# Altium schematic sheet WeightPuzzle.SchDoc: WEIGHT PUZZLE
size A4; DrawnBy: Elisha Tam; Revision: 1
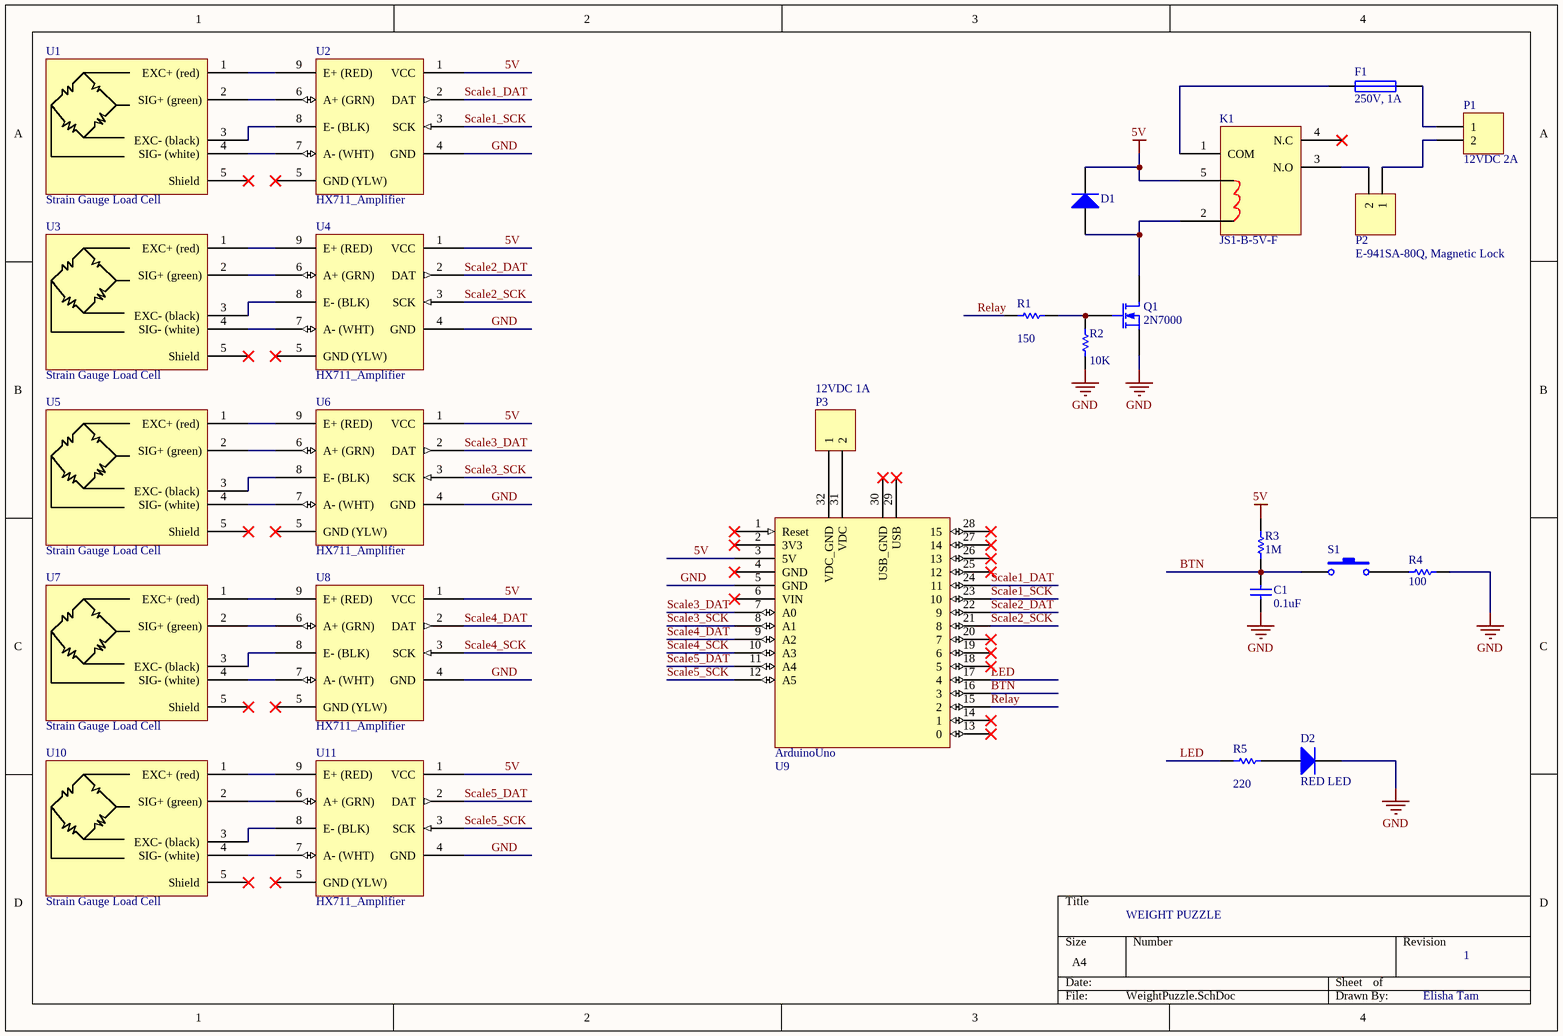
[diagram p0: WeightPuzzle.SchDoc]

## Parts
C1  0.1uF  [RAD-0.3]
D1  Diode  [SMC]  (value not drawn)
D2  RED LED  [SMC]
F1  250V, 1A  [PIN-W2/E2.8]
K1  JS1-B-5V-F
P1  12VDC 2A  [HDR1X2]
P2  E-941SA-80Q, Magnetic Lock  [HDR1X2]
P3  12VDC 1A  [HDR1X2]
Q1  2N7000  [E3]
R1  value 150  [AXIAL-0.3]  (hidden comment: Res1)
R2  value 10K  [AXIAL-0.3]  (hidden comment: Res1)
R3  1M  [AXIAL-0.3]
R4  100  [AXIAL-0.3]
R5  value 220  [AXIAL-0.3]  (hidden comment: Res1)
S1  SW-PB  [SPST-2]  (value not drawn)
U1  Strain Gauge Load Cell
U2  HX711_Amplifier
U3  Strain Gauge Load Cell
U4  HX711_Amplifier
U5  Strain Gauge Load Cell
U6  HX711_Amplifier
U7  Strain Gauge Load Cell
U8  HX711_Amplifier
U9  ArduinoUno
U10  Strain Gauge Load Cell
U11  HX711_Amplifier

## Nets
5V: D1.2(K) K1.5 R3.2 U2.1(VCC) U4.1(VCC) U6.1(VCC) U8.1(VCC) U9.3(5V) U11.1(VCC)
GND: C1.2 D2.2(K) Q1.3(S) R2.1 R4.1 U2.4(GND) U4.4(GND) U6.4(GND) U8.4(GND) U9.5(GND) U11.4(GND)
BTN: C1.1 R3.1 S1.1 U9.16(3)
LED: R5.2 U9.17(4)
Relay: R1.2 U9.15(2)
Scale1_DAT: U2.2(DAT) U9.24(11)
Scale1_SCK: U2.3(SCK) U9.23(10)
Scale2_DAT: U4.2(DAT) U9.22(9)
Scale2_SCK: U4.3(SCK) U9.21(8)
Scale3_DAT: U6.2(DAT) U9.7(A0)
Scale3_SCK: U6.3(SCK) U9.8(A1)
Scale4_DAT: U8.2(DAT) U9.9(A2)
Scale4_SCK: U8.3(SCK) U9.10(A3)
Scale5_DAT: U9.11(A4) U11.2(DAT)
Scale5_SCK: U9.12(A5) U11.3(SCK)
NetD1_1: D1.1(A) K1.2 Q1.1(D)
NetD2_1: D2.1(A) R5.1
NetF1_1: F1.1 K1.1(COM)
NetF1_2: F1.2 P1.1
NetK1_3: K1.3(N.O) P2.2
NetP1_2: P1.2 P2.1
NetP3_1: P3.1 U9.32(VDC_GND)
NetP3_2: P3.2 U9.31(VDC)
NetQ1_2: Q1.2(G) R1.1 R2.2
NetR4_2: R4.2 S1.2
NetU1_1: U1.1(EXC+_(red)) U2.9(E+_(RED))
NetU1_2: U1.2(SIG+_(green)) U2.6(A+_(GRN))
NetU1_3: U1.3(EXC-_(black)) U2.8(E-_(BLK))
NetU1_4: U1.4(SIG-_(white)) U2.7(A-_(WHT))
NetU3_1: U3.1(EXC+_(red)) U4.9(E+_(RED))
NetU3_2: U3.2(SIG+_(green)) U4.6(A+_(GRN))
NetU3_3: U3.3(EXC-_(black)) U4.8(E-_(BLK))
NetU3_4: U3.4(SIG-_(white)) U4.7(A-_(WHT))
NetU5_1: U5.1(EXC+_(red)) U6.9(E+_(RED))
NetU5_2: U5.2(SIG+_(green)) U6.6(A+_(GRN))
NetU5_3: U5.3(EXC-_(black)) U6.8(E-_(BLK))
NetU5_4: U5.4(SIG-_(white)) U6.7(A-_(WHT))
NetU7_1: U7.1(EXC+_(red)) U8.9(E+_(RED))
NetU7_2: U7.2(SIG+_(green)) U8.6(A+_(GRN))
NetU7_3: U7.3(EXC-_(black)) U8.8(E-_(BLK))
NetU7_4: U7.4(SIG-_(white)) U8.7(A-_(WHT))
NetU10_1: U10.1(EXC+_(red)) U11.9(E+_(RED))
NetU10_2: U10.2(SIG+_(green)) U11.6(A+_(GRN))
NetU10_3: U10.3(EXC-_(black)) U11.8(E-_(BLK))
NetU10_4: U10.4(SIG-_(white)) U11.7(A-_(WHT))

Not connected (* = marked no-connect by the designer): K1 4(N.C)*; U1 5(Shield)*; U2 5(GND_(YLW))*; U3 5(Shield)*; U4 5(GND_(YLW))*; U5 5(Shield)*; U6 5(GND_(YLW))*; U7 5(Shield)*; U8 5(GND_(YLW))*; U9 1(Reset)* 2(3V3)* 4(GND)* 6(VIN)* 13(0)* 14(1)* 18(5)* 19(6)* 20(7)* 25(12)* 26(13)* 27(14)* 28(15)* 29(USB)* 30(USB_GND)*; U10 5(Shield)*; U11 5(GND_(YLW))*

## Library data of the parts
C1 = Cap: Capacitor; Published: 8-Jun-2000; LatestRevisionDate: 17-Jul-2002; LatestRevisionNote: Re-released for DXP Platform.; PackageReference: RAD-0.3; Publisher: Altium Limited; PackageDescription: Radial Cap, Thru-Hole; 2 Leads; 0.3 in Pin Spacing; Value: 0.1uF
D1 D2 = Diode: Default Diode; Published: 8-Jun-2000; LatestRevisionDate: 17-Jul-2002; LatestRevisionNote: Re-released for DXP Platform.; PackageVersion: Sep-1996; PackageReference: SMC; Publisher: Altium Limited; PackageDescription: DO-214-AB/SMC; 2 C-Bend Leads; Body 7.9 x 5.9 mm, inc. leads (LxW); Code_JEDEC: DO-214-AB
F1 = Fuse 1: Fuse; Published: 8-Jun-2000; LatestRevisionDate: 17-Jul-2002; LatestRevisionNote: Re-released for DXP Platform.; PackageReference: PIN-W2/E2.8; Publisher: Altium Limited; PackageDescription: Thru-Hole; 2 Leads
K1 = JS1-B-5V-F: SPDT Relay 10A250VAC 10A 125VAC 5V
P1 = Header 2: Header, 2-Pin; LatestRevisionDate: 17-Jul-2002; LatestRevisionNote: Re-released for DXP Platform.; Publisher: Altium Limited
P2 = Header 2: Seco-Larm E-941SA-80Q Mini Maglock, 80 lb.; LatestRevisionDate: 17-Jul-2002; LatestRevisionNote: Re-released for DXP Platform.; Publisher: Altium Limited
P3 = Header 2: 12V DC Adapter; LatestRevisionDate: 17-Jul-2002; LatestRevisionNote: Re-released for DXP Platform.; Publisher: Altium Limited
Q1 = MOSFET-N: N-Channel MOSFET; Published: 8-Jun-2000; LatestRevisionDate: 17-Jul-2002; LatestRevisionNote: Re-released for DXP Platform.; PackageVersion: 1995/1996; PackageReference: E3; Publisher: Altium Limited; PackageDescription: TO, Flat Index; 3 In-Line, Axial Leads; Body Dia. 4.6mm; Lead Dia. 0.5 mm (max)
R1-R5 = Res1: Resistor; Published: 8-Jun-2000; LatestRevisionDate: 17-Jul-2002; LatestRevisionNote: Re-released for DXP Platform.; PackageReference: AXIAL-0.3; Publisher: Altium Limited; PackageDescription: Axial Device, Thru-Hole; 2 Leads; 0.3 in Pin Spacing
  R3: Value: 1M
  R4: Value: 100
S1 = SW-PB: Switch; Published: 24-Mar-1999; LatestRevisionDate: 17-Jul-2002; LatestRevisionNote: Re-released for DXP Platform.; PackageReference: SPST-2; Publisher: Altium Limited; PackageDescription: Switch; 2 Leads
U1 U3 U5 U7 U10 = TAL220: Parallel Beam Load Cell
U2 U4 U6 U8 U11 = HX711_IC: Load Cell Amplifier
U9 = ArduinoUno: Arduino Uno Development Board